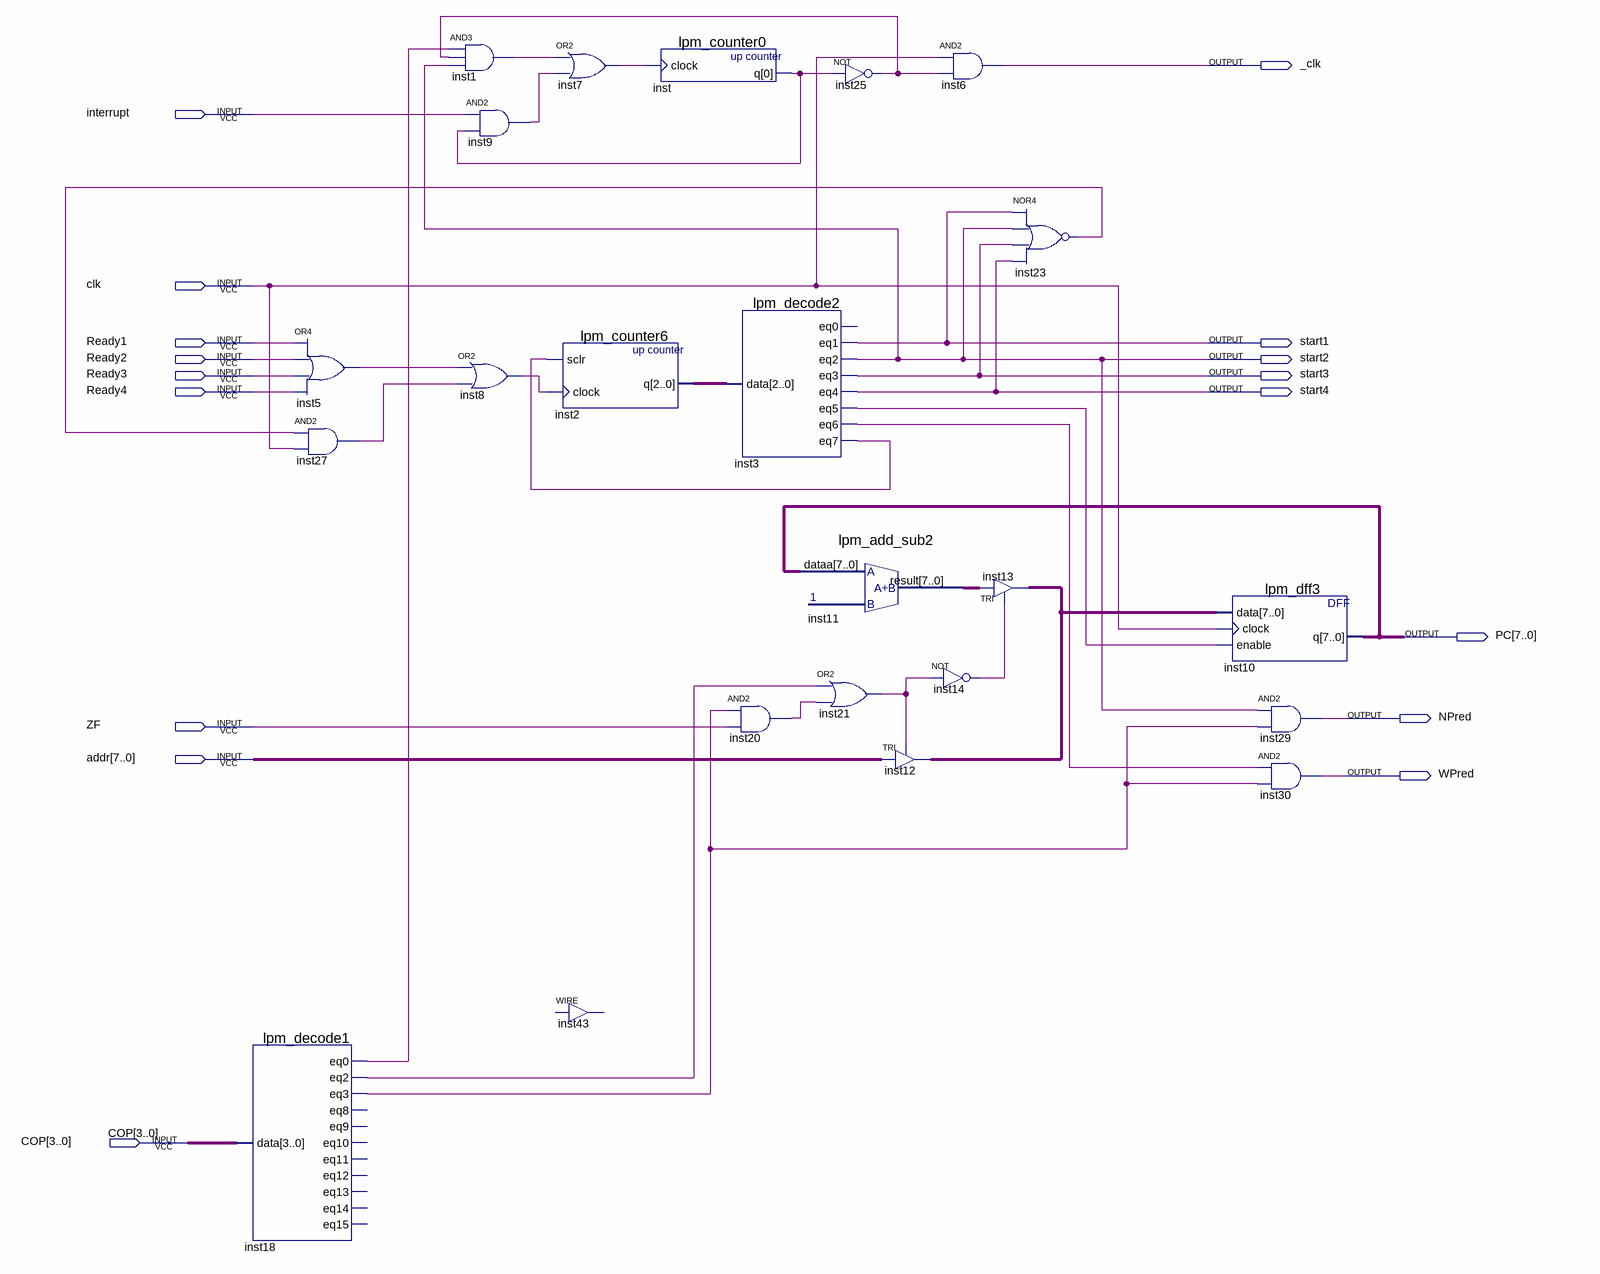
[diagram p0: schematic sheet]
// Quartus schematic ControlDevice.bdf as structural Verilog: 23 symbols, 17 pins
module ControlDevice (
  input  interrupt,
  input  clk,
  input  Ready1,
  input  Ready2,
  input  Ready3,
  input  Ready4,
  input  ZF,
  input  [7:0] addr,
  input  [3:0] COP,
  output _clk,
  output start1,
  output start2,
  output start3,
  output start4,
  output [7:0] PC,
  output NPred,
  output WPred
);

  wire inst1_out, inst3_eq5, inst3_eq6, inst3_eq7, inst5_out, inst7_out, inst8_out, inst9_out, inst14_out,
       inst18_eq0, inst18_eq2, inst18_eq3, inst20_out, inst21_out, inst23_out, inst25_out, inst27_out, inst_q;
  wire [2:0] inst2_q;
  wire [7:0] inst11_result, inst12_out;

  lpm_decode1 inst18 (
    .data(COP), .eq0(inst18_eq0), .eq2(inst18_eq2), .eq3(inst18_eq3));  // open: eq8, eq9, eq10, eq11, eq12, eq13, eq14, eq15
  or inst5 (inst5_out, Ready1, Ready2, Ready3, Ready4);
  and inst27 (inst27_out, inst23_out, clk);
  and inst1 (inst1_out, inst18_eq0, inst25_out, start2);
  or inst8 (inst8_out, inst5_out, inst27_out);
  and inst9 (inst9_out, interrupt, inst_q);
  or inst7 (inst7_out, inst1_out, inst9_out);
  lpm_counter6 inst2 (.sclr(inst3_eq7), .clock(inst8_out), .q(inst2_q));
  // WIRE inst43 has open pins
  lpm_counter0 inst (.clock(inst7_out), .q(inst_q));
  lpm_decode2 inst3 (
    .data(inst2_q), .eq1(start1), .eq2(start2), .eq3(start3), .eq4(start4), .eq5(inst3_eq5), .eq6(inst3_eq6),
    .eq7(inst3_eq7));  // open: eq0
  and inst20 (inst20_out, inst18_eq3, ZF);
  not inst25 (inst25_out, inst_q);
  lpm_add_sub2 inst11 (.dataa(PC), .result(inst11_result));
  or inst21 (inst21_out, inst18_eq2, inst20_out);
  TRI inst12[7:0] (.IN(addr), .OE(inst21_out), .OUT(inst12_out));
  and inst6 (_clk, clk, inst25_out);
  TRI inst13[7:0] (.IN(inst11_result), .OE(inst14_out), .OUT(inst12_out));
  not inst14 (inst14_out, inst21_out);
  nor inst23 (inst23_out, start1, start2, start3, start4);
  lpm_dff3 inst10 (.data(inst12_out), .clock(clk), .enable(inst3_eq5), .q(PC));
  and inst29 (NPred, start2, inst18_eq3);
  and inst30 (WPred, inst3_eq6, inst18_eq3);
endmodule
